# EAGLE design myRolloCtl_v2 (EAGLE 7.6.0)
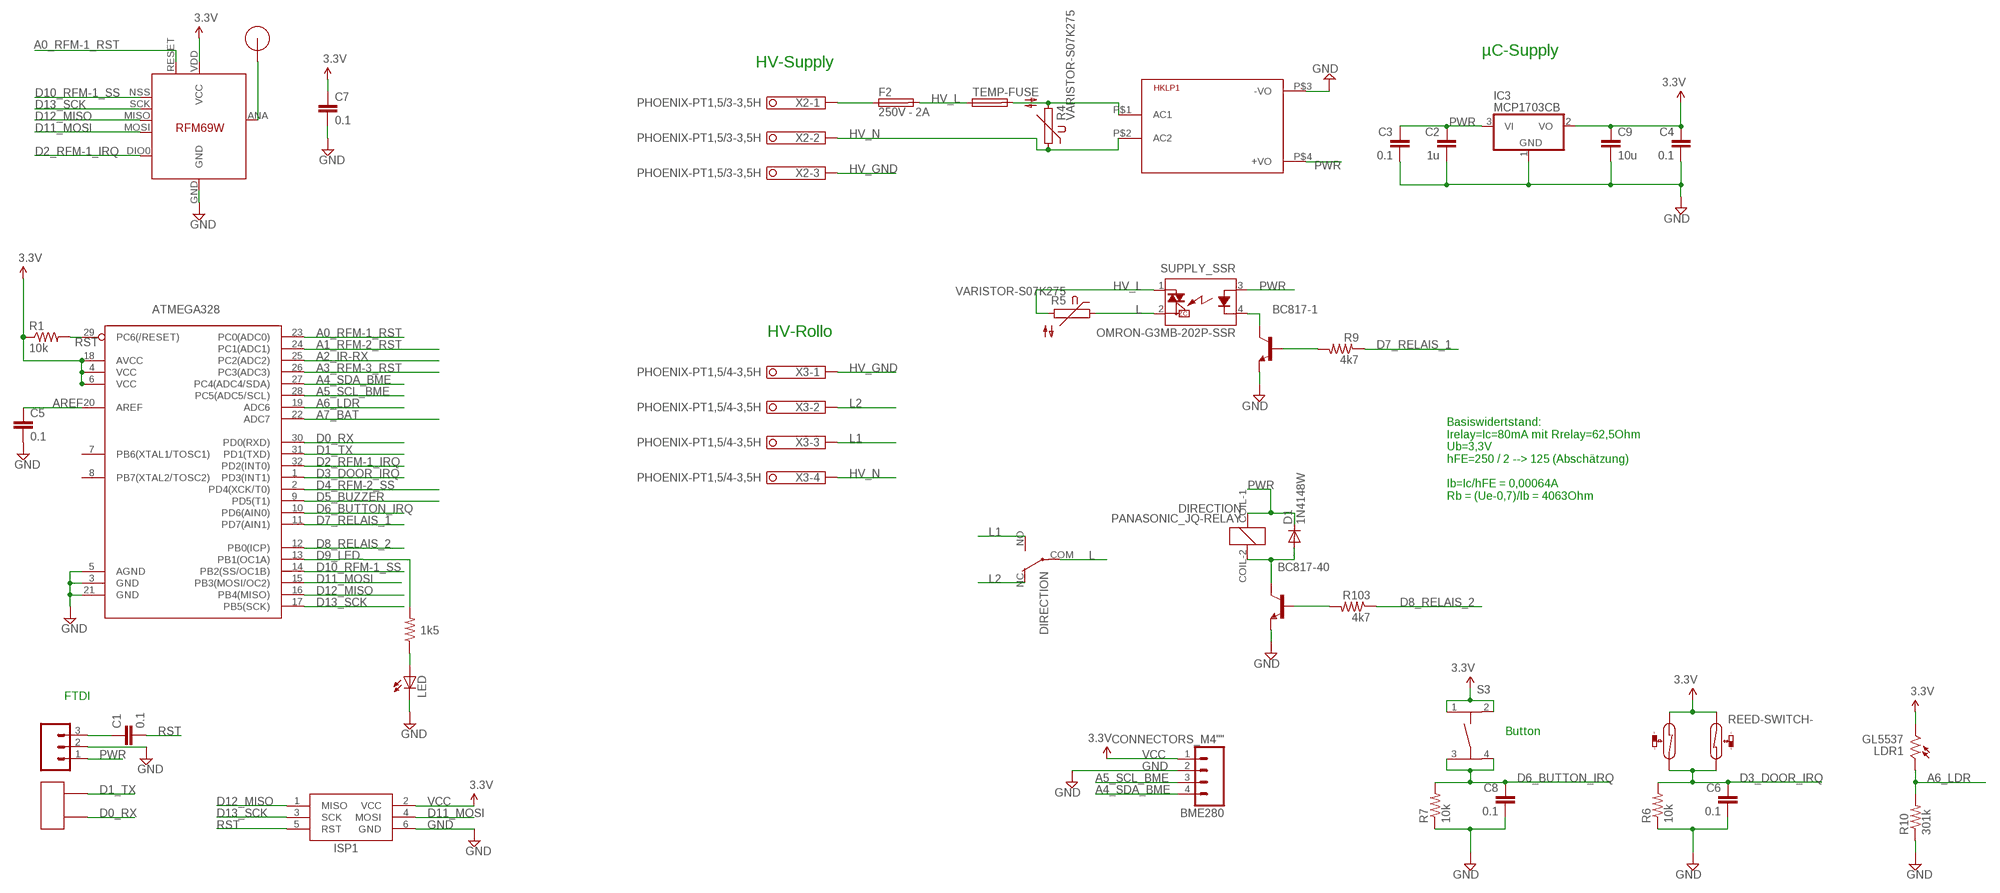
[diagram p0: schematic, sheet 1]

## Parts
ATMEGA328  ATMega-328  ATMEGA168/328TQFP32  [TQFP32-08]
BC817-1  BC817-40-NPN-SOT23-BEC  [SOT23-BEC]
BC817-40  BC817-40-NPN-SOT23-BEC  [SOT23-BEC]
BME280  CONNECTORS_M4""  [CONNECTORS_1X4]
C1  0.1  CAP0603-CAP  [0603-CAP]
C2  1u  CAP0603-CAP  [0603-CAP]
C3  0.1  CAP0603-CAP  [0603-CAP]
C4  0.1  CAP0603-CAP  [0603-CAP]
C5  0.1  CAP0603-CAP  [0603-CAP]
C6  0.1  CAP0603-CAP  [0603-CAP]
C7  0.1  CAP0603-CAP  [0603-CAP]
C8  0.1  CAP0603-CAP  [0603-CAP]
C9  10u  CAP0805-CAP  [0805-CAP]
D1  1N4148W  DIODE-SOD123  [SOD123]
DIRECTION  PANASONIC_JQ-RELAY  [JQ1]
F2  250V - 2A  TE5  [TE5]
HKLP1  HKLPM01  [HKLPM01]
IC3  MCP1703CB  [SOT23]
ISP1  AVRISP  [AVRISP-EDGE]
JP2  CONNECTORS_M3  [CONNECTORS_1X3]
LDR1  GL5537  M9960_11A  [M9960]
LED  LED3MM  [LED3MM]
R1  10k  RESISTOR0603-RES  [0603-RES]
R2  1k5  RESISTOR0603-RES  [0603-RES]
R4  VARISTOR-S07K275  [S07K275]
R5  VARISTOR-S07K275  [S07K275]
R6  10k  RESISTOR0603-RES  [0603-RES]
R7  10k  RESISTOR0603-RES  [0603-RES]
R9  4k7  RESISTOR0603-RES  [0603-RES]
R10  301k  RESISTOR0603-RES  [0603-RES]
R103  4k7  RESISTOR0603-RES  [0603-RES]
S1  REED-SWITCH-  [REED_15X2MM]
S2  REED-SWITCH-  [REED_15X2MM]
S3  TASTER_SMD  [TASTER-1254_SMD]
SUPPLY_SSR  OMRON-G3MB-202P-SSR  [OMRON-G3MB-202P-SSR]
TEMP-FUSE  FUSESW-102T  [TEMP-FUSE]
U$1  RFM12B_ANTENNA  [RFM12B-ANTENNA]
U$2  HDR_2PIN  [1X02_NS]
U$5  RFM69_MINIPADS  [RFM69W-MINPADS]
X2  PHOENIX-PT1,5/3-3,5H  [1984620]
X3  PHOENIX-PT1,5/4-3,5H  [1984633]

## Nets
A0_RFM-1_RST: ATMEGA328.23(PC0(ADC0)) U$5.RESET
A1_RFM-2_RST: ATMEGA328.24(PC1(ADC1))
A2_IR-RX: ATMEGA328.25(PC2(ADC2))
A3_RFM-3_RST: ATMEGA328.26(PC3(ADC3))
A4_SDA_BME: ATMEGA328.27(PC4(ADC4/SDA)) BME280.4
A5_SCL_BME: ATMEGA328.28(PC5(ADC5/SCL)) BME280.3
A6_LDR: ATMEGA328.19(ADC6) LDR1.1 R10.2
A7_BAT: ATMEGA328.22(ADC7)
AREF: ATMEGA328.20(AREF) C5.1
D0_RX: ATMEGA328.30(PD0(RXD)) U$2.1
D1_TX: ATMEGA328.31(PD1(TXD)) U$2.2
D2_RFM-1_IRQ: ATMEGA328.32(PD2(INT0)) U$5.DIO0(DIO0/IRQ)
D3_DOOR_IRQ: ATMEGA328.1(PD3(INT1)) C6.1 R6.2 S1.2 S2.1
D4_RFM-2_SS: ATMEGA328.2(PD4(XCK/T0))
D5_BUZZER: ATMEGA328.9(PD5(T1))
D6_BUTTON_IRQ: ATMEGA328.10(PD6(AIN0)) C8.1 R7.2 S3.3 S3.4
D7_RELAIS_1: ATMEGA328.11(PD7(AIN1)) R9.1
D8_RELAIS_2: ATMEGA328.12(PB0(ICP)) R103.1
D9_LED: ATMEGA328.13(PB1(OC1A)) R2.2
D10_RFM-1_SS: ATMEGA328.14(PB2(SS/OC1B)) U$5.NSS(SEL)
D11_MOSI: ATMEGA328.15(PB3(MOSI/OC2)) ISP1.4(MOSI) U$5.MOSI
D12_MISO: ATMEGA328.16(PB4(MISO)) ISP1.1(MISO) U$5.MISO
D13_SCK: ATMEGA328.17(PB5(SCK)) ISP1.3(SCK) U$5.SCK
GND [power]: ATMEGA328.3(GND) ATMEGA328.5(AGND) ATMEGA328.21(GND) BC817-1.E BC817-40.E BME280.2 C2.2 C3.2 C4.2 C5.2 C6.2 C7.2 C8.2 C9.2 HKLP1.P$3(-VO) IC3.1(GND) ISP1.6(GND) JP2.2 LED.K(C) R6.1 R7.1 R10.1 U$5.GND
HV_GND [HV]: X2.3 X3.1
HV_L [HV]: F2.2 R5.2 SUPPLY_SSR.1(DS1) TEMP-FUSE.1
HV_N [HV]: HKLP1.P$2(AC2) R4.1 X2.2 X3.4
L [HV]: DIRECTION.COM(1:P) R5.1 SUPPLY_SSR.2(DS2)
L1 [HV]: DIRECTION.NO(1:S) X3.3
L2 [HV]: DIRECTION.NC(1:O) X3.2
N$1: BC817-1.B R9.2
N$2: LED.A R2.1
N$3: U$1.P$1 U$5.ANA(ANT)
N$4: BC817-1.C SUPPLY_SSR.4(K)
N$5 [HV]: F2.1 X2.1
N$6 [HV]: HKLP1.P$1(AC1) R4.2 TEMP-FUSE.2
N$7: BC817-40.C D1.A DIRECTION.COIL-2
N$8: C1.1 JP2.3
N$15: BC817-40.B R103.2
PWR [power]: C2.1 C3.1 D1.C DIRECTION.COIL-1 HKLP1.P$4(+VO) IC3.3(VI) JP2.1 SUPPLY_SSR.3(A)
RST: ATMEGA328.29(PC6(/RESET)) C1.2 ISP1.5(RST) R1.2
VCC [power]: ATMEGA328.4(VCC) ATMEGA328.6(VCC) ATMEGA328.18(AVCC) BME280.1 C4.1 C7.1 C9.1 IC3.2(VO) ISP1.2(VCC) LDR1.2 R1.1 S1.1 S2.2 S3.1 S3.2 U$5.VDD(VCC) ; supply symbol labelled 3.3V
Unconnected: ATMEGA328.7(PB6(XTAL1/TOSC1)) ATMEGA328.8(PB7(XTAL2/TOSC2))

## Notes on the sheet
- µC-Supply
- HV-Supply
- HV-Rollo
- Basiswidertstand:
  Irelay=Ic=80mA mit Rrelay=62,5Ohm
  Ub=3,3V
  hFE=250 / 2 --> 125 (Abschätzung)
  
  Ib=Ic/hFE = 0,00064A
  Rb = (Ue-0,7)/Ib = 4063Ohm
- FTDI
- Button

## Library data of the parts
ATMEGA328 = LowPowerLab:ATMEGA168/328: Atmel 32-pin 8-bit micro, 16k flash.; BUERKLIN: 64 S 4010; CONRAD: 155196 - 62
BC817-1 BC817-40 = myLib:*-NPN-: NPN Transistror BF959 corrected 2008.03.06; BUERKLIN: 12S6220
BME280 = myLib:CONNECTORS_M4: 13-pin single row .1" header
C1 C3-C8 = LowPowerLab:CAP: Capacitor Standard 0603 ceramic capacitor, and 0.1" leaded capacitor.; BUERKLIN: 53 D 1726
C2 = LowPowerLab:CAP: Capacitor Standard 0603 ceramic capacitor, and 0.1" leaded capacitor.; BUERKLIN: 53D2083
C9 = myLib:CAP: Capacitor Standard 0603 ceramic capacitor, and 0.1" leaded capacitor.; BUERKLIN: 53 D 2432
D1 = diode:DIODE-: DIODE; BUERKLIN: 26S8142
DIRECTION = myLib:PANASONIC_JQ-RELAY: Power relay Source: Panasonic Electric Works Co., Ltd. / jw.catalog.pdf; BUERKLIN_10A: 31G1062; BUERKLIN_5A: 31G1042
F2 = myLib:TE5: FUSE Wickmann; OC_FARNELL: unknown; OC_NEWARK: unknown
HKLP1 = myLib:HKLPM01
IC3 = linear:MCP1703: 250 mA, 16V, Low Quiescent Current LDO Regulator Source: http://ww1.microchip.com/downloads/en/DeviceDoc/22049b.pdf; CONRAD: 651422-62
ISP1 = myLib:AVRISP: AVR ISP HEADER Standard 6 pin header for AVR programming; BUERKLIN: 56F6228; CONRAD: 737480-62
JP2 = myLib:CONNECTORS_M3: 13-pin single row .1" header; BUERKLIN: 59 F 306
LDR1 = photo-elements:M9960_11: Photo Sensor Beacon Light, Photometer Applications Source: http://optoelectronics.perkinelmer.com/content/Datasheets/DTS_M9960.pdf; EBAY: GL5537
LED = led:LED: LED OSRAM: - CHIPLED LG R971, LG N971, LY N971, LG Q971, LY Q971, LO R971, LY R971 LH N974, LH R974 LS Q976, LO Q976, LY Q976 LO Q996 - Hyper CHIPLED LW Q18S LB Q993, LB Q99A, LB R99A - SideLED LS A670, LO A670, LY A670, LG A670, LP A670 LB A673, LV A673, LT A673, LW A673 LH A674 LY A675 LS A676, LA A676, LO A676, LY A676, LW A676 LS A679, LY A679, LG A679 - Hyper Micro SIDELED® LS Y876, LA Y876, LO Y876, LY Y876 LT Y87S - SmartLED LW L88C, LW L88S LB L89C, LB L89S, LG L890 LS L89K, LO L89K, LY L89K LS L896, LA L896, LO L896, LY L896 - TOPLED LS T670, LO T670, LY T670, LG T670, LP T670 LSG T670, LSP T670, LSY T670, LOP T670, LYG T670 LG T671, LOG T671, LSG T671 LB T673, LV T673, LT T673, LW T673 LH T674 LS T676, LA T676, LO T676, LY T676, LB T676, LH T676, LSB T676, LW T676 LB T67C, LV T67C, LT T67C, LS T67K, LO T67K, LY T67K, LW E67C LS E67B, LA E67B, LO E67B, LY E67B, LB E67C, LV E67C, LT E67C LW T67C LS T679, LY T679, LG T679 LS T770, LO T770, LY T770, LG T770, LP T770 LB T773, LV T773, LT T773, LW T773 LH T774 LS E675, LA E675, LY E675, LS T675 LS T776, LA T776, LO T776, LY T776, LB T776 LHGB T686 LT T68C, LB T68C - Hyper Mini TOPLED® LB M676 - Mini TOPLED Santana® LG M470 LS M47K, LO M47K, LY M47K Source: http://www.osram.convergy.de LUXEON: - LUMILED® LXK2-PW12-R00, LXK2-PW12-S00, LXK2-PW14-U00, LXK2-PW14-V00 LXK2-PM12-R00, LXK2-PM12-S00, LXK2-PM14-U00 LXK2-PE12-Q00, LXK2-PE12-R00, LXK2-PE12-S00, LXK2-PE14-T00, LXK2-PE14-U00 LXK2-PB12-K00, LXK2-PB12-L00, LXK2-PB12-M00, LXK2-PB14-N00, LXK2-PB14-P00, LXK2-PB14-Q00 LXK2-PR12-L00, LXK2-PR12-M00, LXK2-PR14-Q00, LXK2-PR14-R00 LXK2-PD12-Q00, LXK2-PD12-R00, LXK2-PD12-S00 LXK2-PH12-R00, LXK2-PH12-S00 LXK2-PL12-P00, LXK2-PL12-Q00, LXK2-PL12-R00 Source: www.luxeon.com KINGBRIGHT: KA-3528ASYC Source: www.kingbright.com; BUERKLIN: 66 S 9392
R1 R6 R7 = LowPowerLab:RESISTOR: Resistor Basic schematic elements and footprints for 0603, 1206, and PTH resistors.; BUERKLIN: 26 E 816
R2 = LowPowerLab:RESISTOR: Resistor Basic schematic elements and footprints for 0603, 1206, and PTH resistors.; BUERKLIN: 26 E 796
R4 R5 = myLib:VARISTOR-S07K275: VARISTOR; BUERKLIN: 82E2252
R9 R103 = LowPowerLab:RESISTOR: Resistor Basic schematic elements and footprints for 0603, 1206, and PTH resistors.; BUERKLIN: 26 E 808
R10 = LowPowerLab:RESISTOR: Resistor Basic schematic elements and footprints for 0603, 1206, and PTH resistors.; BUERKLIN: 26 E 7197
S1 S2 = myLib:REED-SWITCH-: Reed Sensor
S3 = myLib:TASTER_SMD; BUERKLIN: 13 G 4463; BUERKLIN_2: 13 G 4462; CONRAD_KAPPE: 705141 - 62
SUPPLY_SSR = myLib:OMRON-G3MB-202P-SSR: IT(rms) 8A, Zero Cross type SIP 4pin Triac output SSR Source: http://sharp-world.com/products/device/lineup/data/pdf/datasheet/s102s02_e.pdf
TEMP-FUSE = myLib:FUSE: LITTLEFUSE Picofuse/slow Littlefuse; BUERKLIN: 30G4800
U$1 = LowPowerLab:RFM12B_ANTENNA
U$2 = myLib:HDR_2PIN; BUERKLIN: 59 F 306
U$5 = myLib:RFM69_MINIPADS
X2 = myLib:PHOENIX-PT1,5/3-3,5H: MKDS 1/ 3-3,5 Printklemme Nennstrom: 10 A Bemessungsspannung: 160 V Raster: 3,5 mm Polzahl: 3 Montageart: Löten Anschlussart: Schraubanschluss Anschlussrichtung vom Leiter zur Platine: 0° Source: http://eshop.phoenixcontact.com .. 1751251.pdf; BUERKLIN: 09H2301
X3 = myLib:PHOENIX-PT1,5/4-3,5H: MKDS 1/ 3-3,5 Printklemme Nennstrom: 10 A Bemessungsspannung: 160 V Raster: 3,5 mm Polzahl: 3 Montageart: Löten Anschlussart: Schraubanschluss Anschlussrichtung vom Leiter zur Platine: 0° Source: http://eshop.phoenixcontact.com .. 1751251.pdf; BUERKLIN: 09H2302

## Net classes
0 default: width 0.305 mm, clearance 0.254 mm
1 power: width 0.381 mm, clearance 0.254 mm
2 HV: width 1.778 mm, clearance 1.016 mm

## Board
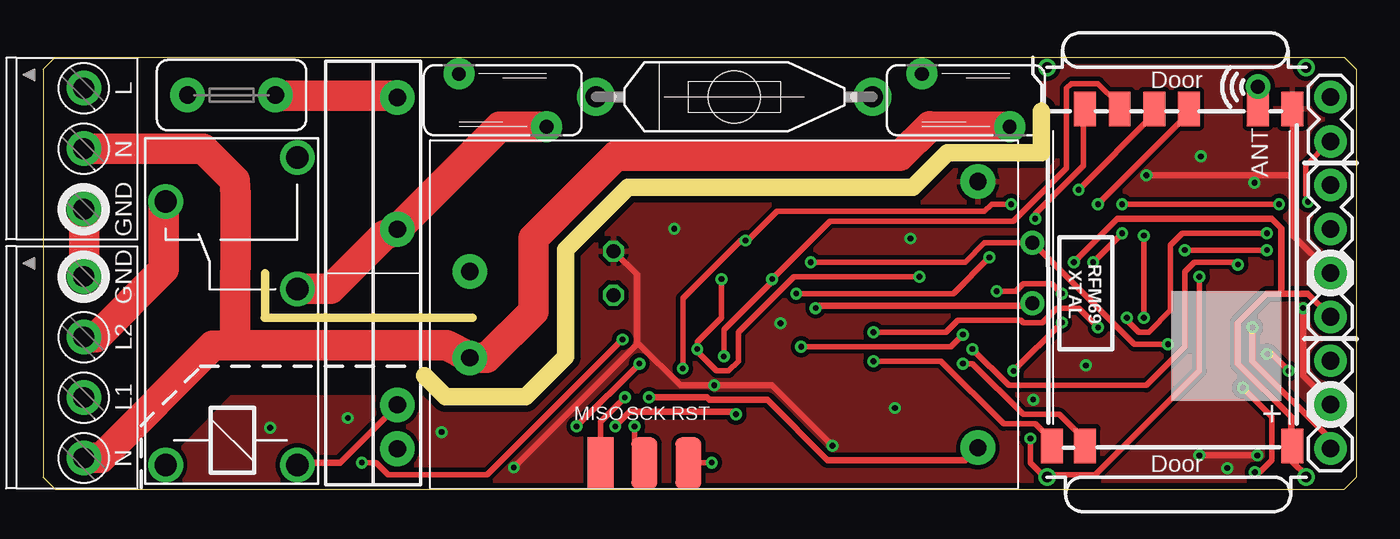
[diagram p1: board, top side]
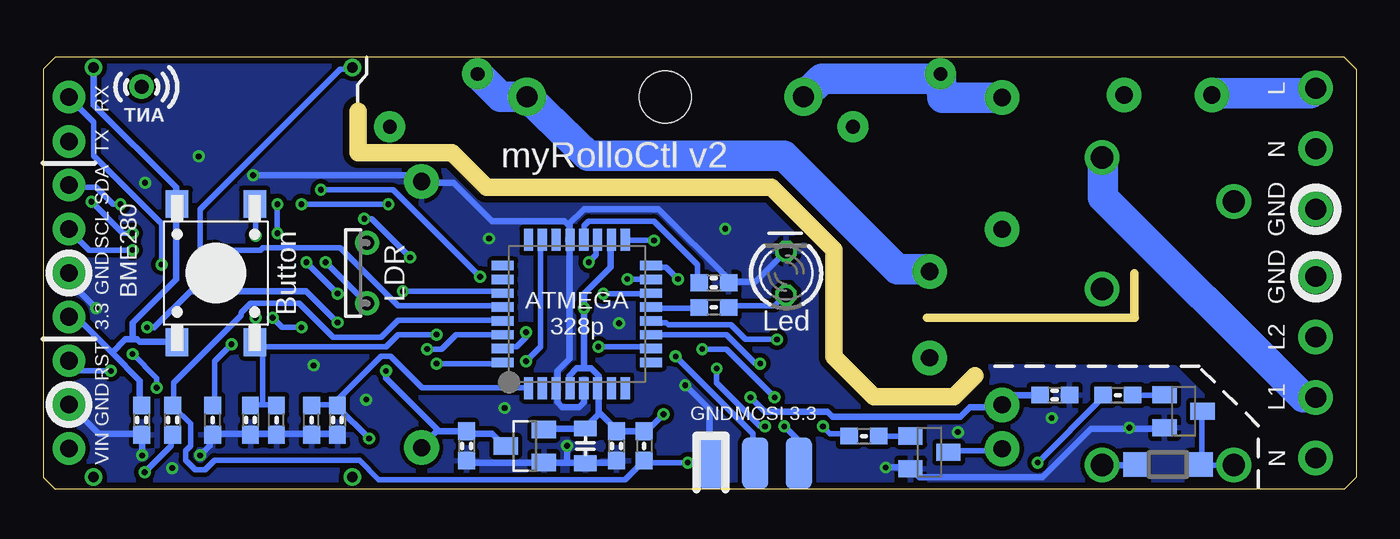
[diagram p2: board, bottom side, seen from below]

Size 76 x 25 mm. Coordinates in mm from the lower left corner, seen from the top.
Outline: 22.07,6.55 23.29,5.33 27.91,5.36 30.23,7.67 30.23,13.87 33.84,17.48 50.34,17.48 52.32,19.46 57.78,19.46 57.78,21.87
Outline: 12.83,9.92 24.86,9.92
Outline: 12.84,10.04 12.84,12.48
Outline: 0.7,0 75.3,0 76,0.7 76,24.3 75.3,25 0.7,25 0,24.3 0,0.7 0.7,0
Copper layers (1*16): Top 0.0356mm / dielectric 1.5011mm / Bottom 0.0356mm
Design rules "oshpark-2layer *": minimum track width 6mil, minimum drill 13mil, track to track 6mil, track to pad 6mil, pad to pad 6mil, via to via 6mil, smd to smd 6mil, copper to edge 15mil, drill to drill 6mil, minimum pad ring 7mil, minimum via ring 7mil, stop-mask expansion 2.5mil, vias tented up to drill 100mil, thermal gap 10mil
Holes 3 mm at 40,22.7
bRestrict: area 26.5,17.9 to 27.1,18.5

### Footprints (pad centres in the part's own frame; a part is rotated, then mirrored left to right if it is on the bottom)
TQFP32-08 = smd 1.27 x 0.533: 1 -4.293,2.8; 2 -4.293,2; 3 -4.293,1.2; 4 -4.293,0.4; 5 -4.293,-0.4; 6 -4.293,-1.2; 7 -4.293,-2; 8 -4.293,-2.8; 17 4.293,-2.8; 18 4.293,-2; 19 4.293,-1.2; 20 4.293,-0.4; 21 4.293,0.4; 22 4.293,1.2; 23 4.293,2; 24 4.293,2.8 | smd 0.533 x 1.27: 9 -2.8,-4.293; 10 -2,-4.293; 11 -1.2,-4.293; 12 -0.4,-4.293; 13 0.4,-4.293; 14 1.2,-4.293; 15 2,-4.293; 16 2.8,-4.293; 25 2.8,4.293; 26 2,4.293; 27 1.2,4.293; 28 0.4,4.293; 29 -0.4,4.293; 30 -1.2,4.293; 31 -2,4.293; 32 -2.8,4.293
SOT23-BEC = smd 1 x 1.4: B -0.95,-1.1; C 0,1.1; E 0.95,-1.1
CONNECTORS_1X4 = drill 1.016 pad 1.88: 1 0,0; 2 2.54,0; 3 5.08,0; 4 7.62,0
0603-CAP = smd 1.016 x 0.965: 1 -0.85,0; 2 0.85,0
0805-CAP = smd 0.902 x 1.3: 1 -1,0; 2 1,0
SOD123 = smd 1.4 x 1.4: A 1.9,0; C -1.9,0
JQ1 = drill 1.3 pad 2: COIL-1 -8.89,-3.81; COIL-2 -8.89,3.81; COM 1.27,-3.81; NC 6.35,3.81; NO 8.89,-3.81
TE5 = drill 1 pad 2: 1 -2.54,0; 2 2.54,0
HKLPM01 = drill 1 pad 2: P$1 -14.7,2.5; P$2 -14.7,-2.5; P$3 14.7,7.7; P$4 14.7,-7.7
SOT23 = smd 1 x 1.4: 1 -0.95,-1.1; 2 0.95,-1.1; 3 0,1.1
AVRISP-EDGE = smd 3 x 1.5: 1 1.5,2.54; 3 1.5,0; 5 1.5,-2.54 | smd 3 x 1.5 bottom: 2 1.5,2.54; 4 1.5,0; 6 1.5,-2.54
CONNECTORS_1X3 = drill 1.016 pad 1.88: 1 0,0; 2 2.54,0; 3 5.08,0
M9960 = drill 0.8 pad 1.4: 1 -1.75,0; 2 1.75,0
LED3MM = drill 0.813 octagon: A -1.27,0; K 1.27,0
0603-RES = smd 1.016 x 0.965: 1 -0.85,0; 2 0.85,0
S07K275 = drill 0.8 pad 1.8: 1 -1.524,-2.54; 2 1.524,2.54
REED_15X2MM = drill 0.6 pad 1.016: 1 -7.5,0; 2 7.5,0
TASTER-1254_SMD = smd 1.6 x 1.3: 1 -4,2.25; 2 4,2.25; 3 -4,-2.25; 4 4,-2.25
OMRON-G3MB-202P-SSR = drill 1 pad 2: 1 -10.16,1.4; 2 -2.54,1.4; 3 7.62,1.4; 4 10.16,1.4
TEMP-FUSE = drill 1.2 pad 2.2: 1 -8,0; 2 8,0
RFM12B-ANTENNA = drill 0.8 pad 1.422: P$1 0,0
1X02_NS = drill 1.016 pad 1.88: 1 -1.28,0; 2 1.28,0
RFM69W-MINPADS = smd 2 x 1.27: ANA 8,-5; DIO0 -11.5,5; GND 8,-7; MISO 8,1; MOSI 8,3; NSS 8,5; RESET -11.5,6.909; SCK 8,-1; VDD -11.5,-7
1984620 = drill 1.2 pad 2: 1 -3.5,0; 2 0,0; 3 3.5,0
1984633 = drill 1.2 pad 2: 1 -3.5,0; 2 0,0; 3 3.5,0; 4 7,0

### Placement (x,y rotation side)
ATMEGA328  45.11,10.13 90 bottom
BC817-1  24.7,2.13 270 bottom
BC817-40  10,4.51 270 bottom
BME280  74.5,9.97 90 top
C1  68.5,4 90 bottom
C2  51.5,2.5 270 bottom
C3  17.45,5.45 0 bottom
C4  42.82,2.5 270 bottom
C5  37.18,11.94 0 bottom
C6  58.97,4 270 bottom
C7  70.3,4 270 bottom
C8  64,4 270 bottom
C9  44.62,2.5 270 bottom
D1  10.9,1.42 0 bottom
DIRECTION  10.9,10.3 90 top
F2  10.9,22.8 0 top
HKLP1  39.4,10.1 0 top
IC3  48.12,2.5 90 bottom
ISP1  34.8,0 90 top
JP2  74.5,2.35 90 top
LDR1  57.25,12.5 270 bottom
LED  33,12.5 90 bottom
R1  41.22,2.5 270 bottom
R2  37.18,10.51 180 bottom
R4  53.4,22.5 90 top
R5  26.6,22.5 90 top
R6  60.47,4 90 bottom
R7  62.5,4 90 bottom
R9  28.5,3.08 0 bottom
R10  66.19,4 90 bottom
R103  13.8,5.45 0 bottom
S1  65.6,0.7 180 top
S2  65.6,24.4 0 top
S3  66,12.5 90 bottom
SUPPLY_SSR  19.1,12.5 270 top
TEMP-FUSE  40,22.7 0 top
U$1  70.31,23.29 90 bottom
U$2  74.5,21.4 270 top
U$5  65.3,14 90 top
X2  2.35,19.7 270 top
X3  2.35,8.8 270 top

### Tracks (layer width: path | path; a pad name or v marks a point on that pad's centre or on a via)
A0_RFM-1_RST  (via drill 0.33)
  Top 0.305: v48.06,7.4 51.97,7.4 55.6,3.77 57.42,3.77 58.26,2.93 58.26,2.52 U$5.RESET
  Bottom 0.305: v48.06,7.4 47.22,8.24 47.22,14.39 ATMEGA328.23
A4_SDA_BME  (via drill 0.33)
  Top 0.305: v55.18,11.46 56.3,11.46 56.72,11.87 58.4,11.87 v58.95,11.32 | v62.45,14.81 v60.77,13.13 | v71.53,16.48 v62.45,16.48
  Bottom 0.305: v55.18,11.46 49.45,11.46 ATMEGA328.27 | v60.77,13.13 v58.95,11.32 | v62.45,16.48 v62.45,14.81 | v71.53,16.48 71.94,16.48 72.92,17.46 74.46,17.46 BME280.4
A5_SCL_BME  (via drill 0.33)
  Top 0.305: v70.83,13.83 v66.08,13.83
  Bottom 0.305: v66.08,13.83 63.42,13.83 63.28,13.97 58.81,13.97 55.46,10.62 49.45,10.62 ATMEGA328.28 | v70.83,13.83 73.34,13.83 74.46,14.95 BME280.3
A6_LDR  (via drill 0.33)
  Top 0.305: v65.1,8.38 63.14,8.38 57.28,14.25 LDR1.1 57.14,14.25 54.48,14.25 53.37,13.13 v44.42,13.13
  Bottom 0.305: v65.1,8.38 66.08,7.4 66.08,4.89 R10.2 | v44.42,13.13 44.01,13.55 44.01,14.39 ATMEGA328.19
AREF
  Bottom 0.305: C5.1 38.14,12.01 38.14,12.99 40.65,15.51 44.42,15.51 44.7,15.23 44.7,14.53 ATMEGA328.20
D0_RX  (via drill 0.33)
  Top 0.305: v53.78,8.1 55.88,6.01 63.84,6.01 66.08,8.24 66.08,12.57 66.64,13.13 69.01,13.13 v69.15,12.99
  Bottom 0.305: v53.78,8.1 52.95,8.1 52.11,8.94 49.45,8.94 ATMEGA328.30 | v69.15,12.99 69.15,15.37 73.06,19.28 73.06,21.23 74.46,22.63 U$2.1
D1_TX  (via drill 0.33)
  Top 0.305: v48.06,9.08 52.25,9.08 52.95,9.78 56.58,9.78 56.72,9.64 57.84,9.64 58.67,10.48 59.93,10.48 v61.05,9.36 | v62.73,9.92 62.73,9.78 63.42,9.08 63.98,9.08 65.24,10.34 65.24,14.11 65.94,14.81 v70.83,14.81 | v73.2,16.62 73.2,16.9 73.06,17.04 73.06,18.72 74.46,20.12 U$2.2
  Bottom 0.305: v48.06,9.08 48.06,8.8 48.62,8.24 49.31,8.24 ATMEGA328.31 | v61.05,9.36 62.17,9.36 v62.73,9.92 | v70.83,14.81 71.39,14.81 v73.2,16.62
D2_RFM-1_IRQ  (via drill 0.33)
  Top 0.305: v53.23,7.26 53.78,7.26 56.72,4.33 58.81,4.33 60.21,2.93 60.21,2.52 U$5.DIO0
  Bottom 0.305: v53.23,7.26 49.45,7.26 ATMEGA328.32
D3_DOOR_IRQ  (via drill 0.33)
  Top 0.305: v57.14,2.93 57.14,1.54 57.84,0.84 57.98,0.84 S1.2 58.12,0.84 60.91,0.84 66.92,6.84 v66.92,12.29
  Bottom 0.305: C6.1 59.09,4.89 60.35,4.89 R6.2 | ATMEGA328.1 47.92,5.87 54.06,5.87 55.88,7.68 56.44,7.68 59.09,5.03 C6.1 | v57.14,2.93 58.95,4.75 C6.1 | v66.92,12.29 66.92,16.2 58.81,24.31 58.12,24.31 S2.1
D6_BUTTON_IRQ  (via drill 0.33)
  Top 0.305: v43.87,8.24 52.53,8.24 v53.23,8.94 | v63.7,9.92 v63.7,14.67
  Bottom 0.305: 63.28,4.89 63.98,4.89 C8.1 | 63.28,4.89 62.59,4.89 R7.2 | v43.87,8.24 40.93,8.24 ATMEGA328.10 | v53.23,8.94 55.46,8.94 56.16,8.24 63.56,8.24 63.7,8.38 S3.3 | 63.28,4.89 63.28,8.1 S3.3 | v63.7,14.67 63.7,16.48 S3.4 | v63.7,9.92 63.7,8.52 S3.3
D7_RELAIS_1  (via drill 0.33)
  Top 0.305: v34.51,7.26 v30.87,3.63
  Bottom 0.305: v30.87,3.63 30.45,3.21 29.48,3.21 R9.1 | v34.51,7.26 34.78,7.26 36.46,8.94 40.79,8.94 ATMEGA328.11
D8_RELAIS_2  (via drill 0.33)
  Top 0.305: v18.44,1.54 19.28,1.54 19.98,0.84 25.7,0.84 v33.53,8.66
  Bottom 0.305: v18.44,1.54 14.67,5.31 R103.1 | v33.53,8.66 35.34,8.66 36.18,9.5 39.81,9.5 39.95,9.64 40.79,9.64 ATMEGA328.12
D9_LED
  Bottom 0.305: R2.2 38.14,10.48 40.79,10.48 ATMEGA328.13
D10_RFM-1_SS  (via drill 0.33)
  Top 0.305: v43.59,11.32 52.67,11.32 v54.76,13.41 | v57.42,15.65 57.42,15.93 60.21,18.72 60.21,21.93 U$5.NSS
  Bottom 0.305: v43.59,11.32 40.93,11.32 ATMEGA328.14 | v54.76,13.41 57,15.65 v57.42,15.65
D11_MOSI  (via drill 0.33)
  Top 0.305: U$5.MOSI 62.17,22.07 62.17,22.35 61.05,23.47 59.51,23.47 59.23,23.19 59.23,18.58 56.16,15.51 45.54,15.51 v42.19,12.15 42.19,12.01 39.4,9.22 v39.4,7.68
  Bottom 0.305: v42.19,12.15 40.93,12.15 ATMEGA328.15 | v39.4,7.68 34.92,3.21 34.92,1.54 ISP1.4
D12_MISO  (via drill 0.33)
  Top 0.305: v39.26,12.15 39.26,9.92 37.86,8.52 v37.86,8.1 37.86,7.96 38.98,6.84 39.67,6.84 40.23,7.4 40.23,9.08 43.45,12.29 v50.71,12.29 | v33.67,5.31 32.27,3.91 32.27,1.54 ISP1.1 | v59.93,17.32 64.26,21.65 64.26,21.93 U$5.MISO
  Bottom 0.305: v39.26,12.15 39.95,12.85 40.79,12.85 ATMEGA328.16 | v37.86,8.1 36.46,8.1 v33.67,5.31 | v59.93,17.32 55.74,17.32 v50.71,12.29
D13_SCK  (via drill 0.33)
  Top 0.305: v37.02,6.99 37.02,11.04 40.37,14.39 v40.65,14.39 40.79,14.39 42.47,16.07 54.48,16.07 54.9,16.48 v56.02,16.48 | v34.23,3.63 34.23,2.1 34.78,1.54 ISP1.3 | v61.05,16.48 66.22,21.65 66.22,21.93 U$5.SCK
  Bottom 0.305: v40.65,14.39 42.19,14.39 ATMEGA328.17 | v37.02,6.99 37.02,6.15 34.51,3.63 v34.23,3.63 | v56.02,16.48 v61.05,16.48
GND  (via drill 0.33)
  Top 0.381: 72.36,18.16 72.36,14.67 74.46,12.57 BME280.2 | 72.36,18.16 72.36,21.93 U$5.GND | v70.27,1.96 v66.92,1.96 | v72.92,10.48 72.92,6.57 74.46,5.03 JP2.2 | 34.44,8.45 34.37,8.52 34.37,12.43 33.11,13.69 LED.K | 34.44,8.45 36.88,6.01 v38.84,6.01 42.19,6.01 v45.68,2.52 | 34.44,8.45 v27.24,1.26 | v63.84,18.16 72.36,18.16
  Bottom 0.381: C6.2 59.09,3.21 60.35,3.21 R6.1 60.63,3.21 62.45,3.21 R7.1 62.59,3.21 63.98,3.21 C8.2 64.12,3.21 66.08,3.21 R10.1 66.36,3.07 66.36,2.52 v66.92,1.96 | JP2.2 74.46,4.89 72.78,3.21 70.41,3.21 C7.2 70.27,3.07 v70.27,1.96 | v72.92,10.48 74.46,12.01 74.46,12.43 BME280.2 | ATMEGA328.5 44.7,5.73 44.7,5.03 44.98,4.75 45.96,4.75 46.24,5.03 46.24,5.73 ATMEGA328.3 46.24,6.01 46.24,6.84 45.54,7.54 45.54,14.39 ATMEGA328.21 45.54,14.53 45.54,15.23 45.61,15.3 | 45.61,15.3 45.82,15.51 50.01,15.51 52.25,17.74 54.06,17.74 HKLP1.P$3 54.2,17.88 54.48,18.16 v63.84,18.16 | BC817-40.E 11.18,3.49 15.37,3.49 18.16,0.7 25.29,0.7 25.7,1.12 BC817-1.E 25.84,1.26 v27.24,1.26 | C4.2 42.89,1.54 44.56,1.54 C9.2 44.7,1.54 45.68,1.54 | C2.2 51.41,1.54 47.08,1.54 IC3.1 46.94,1.54 45.68,1.54 | LED.K 33.11,13.69 34.78,12.01 36.32,12.01 C5.2 36.32,12.15 40.37,16.2 44.7,16.2 45.61,15.3 | v38.84,6.01 37.44,4.61 37.44,1.54 ISP1.6 | v45.68,2.52 45.68,1.54
  other vias: 50.19,14.5 67.01,19.25 70.1,17.73 68.53,1.22 60.35,7.16 57.3,5.18 49.3,4.7 42.67,9.6 36.53,15.06 23.06,3.3 17.63,4.11 13.13,3.56
  pour Top: 78.54,-1.96 78.54,26.21 57.89,26.19 57.89,19.56 52.35,19.58 50.01,17.25 33.68,17.25 30.23,13.79 30.23,7.77 27.79,5.33 23.32,5.3 10.9,5.3 7.53,1.8 7.53,-1.5
  pour Bottom: 77.42,-1.04 77.42,25.55 57.96,25.55 57.96,19.63 52.35,19.63 50.14,17.42 33.93,17.42 30.3,13.79 30.3,7.8 27.89,5.38 23.11,5.38 21.39,7.11 10.54,7.04 6.88,3.38 7.01,-1.04
HV_GND
  Top 1.778: X3.1 2.38,12.43 2.38,16.07 X2.3
HV_L
  Top 1.778: SUPPLY_SSR.1 20.4,22.77 13.55,22.77 F2.2
  Bottom 1.778: 20.4,22.63 SUPPLY_SSR.1 23.96,22.66 R5.2 arc90 24.31,23.75 30.93,23.75 TEMP-FUSE.1
HV_N
  Top 1.778: 11.12,8.33 23.36,8.33 24.59,7.68 HKLP1.P$2 25.66,7.6 28.37,10.31 28.37,14.53 33.15,19.3 49.58,19.3 51.33,21 R4.1 | 11.12,8.33 9.82,8.31 3.35,1.82 2.38,1.82 X3.4 | X2.2 2.38,19.7 9.26,19.7 11.07,17.88 11.15,17.04 11.12,8.33
L
  Top 1.778: R5.1 28.92,20.95 26.4,20.95 20.54,15.09 SUPPLY_SSR.2 19.7,14.67 16.62,11.6 14.81,11.6 DIRECTION.COM
L1
  Bottom 1.778: X3.3 2.38,5.31 3.07,5.31 14.67,16.9 14.67,19.14 DIRECTION.NO
L2
  Top 1.778: X3.2 2.38,8.8 3.07,8.8 6.99,12.71 6.99,16.62 DIRECTION.NC
N$1
  Bottom 0.305: R9.2 27.52,3.07 25.84,3.07 BC817-1.B
N$2
  Bottom 0.305: R2.1 36.32,10.62 33.67,10.62 33.11,11.18 LED.A
N$3
  Top 0.305: U$5.ANA 70.27,22.07 70.27,23.19 U$1.P$1
N$4
  Bottom 0.305: BC817-1.C 23.47,2.23 20.54,2.23 SUPPLY_SSR.4
N$5
  Bottom 1.778: F2.1 8.24,22.91 2.65,22.91 2.38,23.19 X2.1
N$6
  Bottom 1.778: HKLP1.P$1 24.73,12.71 26.56,12.74 33.12,19.28 44.46,19.3 47.92,22.63 TEMP-FUSE.2 49.54,22.7 R4.2
N$7
  Bottom 0.305: DIRECTION.COIL-2 7.12,1.4 8.94,1.4 D1.A 8.94,1.54 8.94,4.47 BC817-40.C
N$8  (via drill 0.33)
  Top 0.305: v70.13,0.98 70.41,0.98 71.11,1.68 71.11,4.19 v69.43,5.87 | v70.83,7.82 71.11,7.82 v72.08,6.84
  Bottom 0.305: v70.13,0.98 68.59,2.52 68.59,3.07 C1.1 | v69.43,5.87 69.43,6.43 v70.83,7.82 | v72.08,6.84 73.9,6.84 74.46,7.4 JP2.3
N$15
  Bottom 0.305: R103.2 12.85,5.45 11.18,5.45 BC817-40.B
PWR  (via drill 0.33)
  Top 0.381: DIRECTION.COIL-1 14.81,1.54 17.18,1.54 20.4,4.75 SUPPLY_SSR.3 | v69.99,9.36 69.99,7.4 74.46,2.93 74.46,2.38 JP2.1 | v56.16,6.84 v58.95,9.64 | v35.06,5.31 38.42,5.31 38.56,5.17 41.91,5.17 45.4,1.68 53.37,1.68 54.06,2.38 HKLP1.P$4
  Bottom 0.381: D1.C 12.85,1.4 14.67,1.4 DIRECTION.COIL-1 | IC3.3 49.31,2.52 50.01,3.21 51.41,3.21 C2.1 51.69,3.35 53.23,3.35 | 53.23,3.35 54.06,2.52 HKLP1.P$4 | v69.99,9.36 69.57,9.36 67.47,11.46 60.77,11.46 v58.95,9.64 | v56.16,6.84 56.16,6.43 53.23,3.49 53.23,3.35 | v35.06,5.31 34.23,4.47 30.59,4.47 30.32,4.19 22.91,4.19 22.35,4.75 20.54,4.75 SUPPLY_SSR.3 19.93,5.45 C3.1
RST  (via drill 0.33)
  Top 0.305: v38.7,1.54 37.44,1.54 ISP1.5
  Bottom 0.305: v38.7,1.54 41.21,1.54 R1.2 41.35,1.54 42.33,0.56 56.58,0.56 57.7,1.68 66.08,1.68 66.64,1.12 67.2,1.12 67.75,1.68 67.75,2.23 67.47,2.52 67.47,3.77 68.45,4.75 C1.2 68.45,4.89 68.45,6.15 64.54,10.06 64.54,10.2 63.98,10.76 61.19,10.76 59.23,8.8 56.44,8.8 55.46,9.78 49.45,9.78 ATMEGA328.29
VCC  (via drill 0.33)
  Top 0.381: S1.1 73.06,0.84 72.36,1.54 72.36,2.38 U$5.VDD 72.22,2.65 72.22,4.19 69.15,7.26 69.15,9.64 70.83,11.32 71.67,11.32 | 71.67,11.32 73.2,11.32 74.46,10.06 BME280.1 | v44.7,10.48 44.84,10.62 57.14,10.62 LDR1.2 | v33.11,3.63 33.95,4.47 39.95,4.47 v40.09,4.33 | 71.67,11.32 71.67,15.09 71.11,15.65 62.17,15.65 v59.65,13.13
  Bottom 0.381: 72.02,7.89 74.04,9.92 74.46,9.92 BME280.1 | 72.02,7.89 70.41,6.29 70.41,4.89 C7.1 | 70.83,8.66 71.25,8.66 72.02,7.89 | 70.83,8.66 70.55,8.66 70.41,8.52 68.31,8.52 S3.1 | 70.83,8.66 70.83,9.64 68.31,12.15 68.31,16.48 S3.2 68.31,16.62 68.31,17.46 73.06,22.21 73.06,24.31 S2.2 | 43.87,4.33 43.87,5.73 ATMEGA328.6 43.87,6.01 43.87,6.57 44.28,6.99 44.7,6.99 | 43.87,4.33 44.56,3.63 C9.1 44.7,3.49 46.94,3.49 IC3.2 | 44.7,6.99 45.12,6.99 45.54,6.57 45.54,5.87 ATMEGA328.4 | 44.7,6.99 v44.7,10.48 44.7,11.32 43.17,12.85 43.17,14.39 ATMEGA328.18 | 43.87,4.33 43.73,4.33 42.89,3.49 C4.1 42.75,3.35 41.35,3.35 R1.1 41.07,3.35 v40.09,4.33 | v33.11,3.63 32.27,2.79 32.27,1.54 ISP1.2 | v59.65,13.13 57.28,10.76 LDR1.2

### Text on the board
tPlace: RFM69 / XTAL
tDocu: REG
_tsilk: Door | L | N | GND | GND | L2 | L1 | MISO | SCK | RST | N | Door
_bsilk: L | RX | ANT | N | TX | myRolloCtl v2 | SDA | GND | SCL | BME280 | GND | LDR | Button | GND | ATMEGA / 328p | 3.3 | L2 | Led | RST | L1 | 3.3 | MOSI | GND | GND | N | VIN